# EAGLE design interacto (EAGLE 6.3)
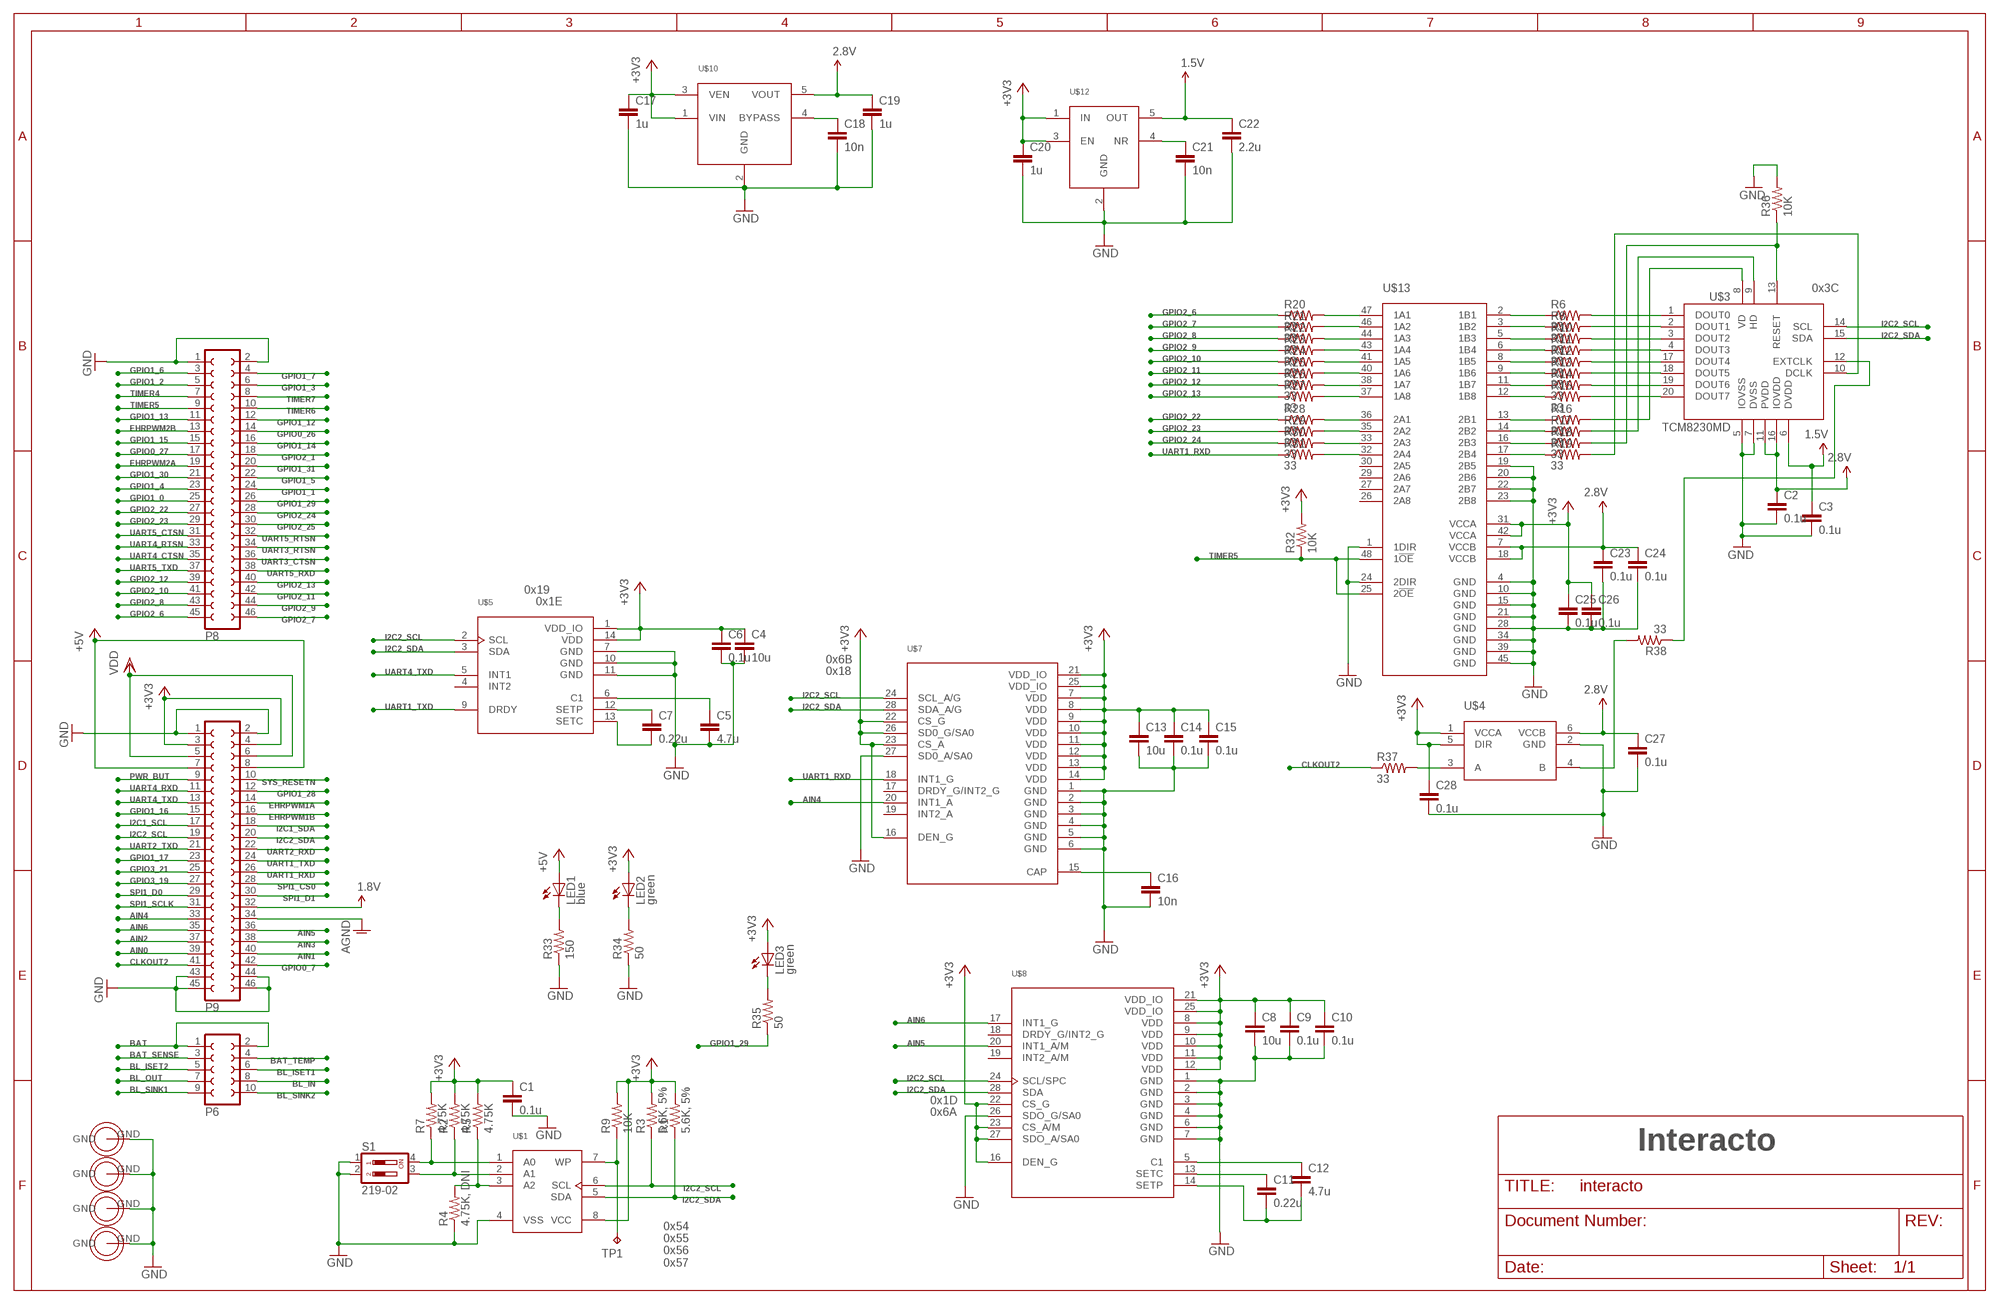
[diagram p0: schematic, sheet 1]

## Parts
C1  0.1u  C-EUC0603  [C0603]
C2  0.1u  C-EUC0603  [C0603]
C3  0.1u  C-EUC0603  [C0603]
C4  10u  C-EUC0603  [C0603]
C5  4.7u  C-EUC0603  [C0603]
C6  0.1u  C-EUC0603  [C0603]
C7  0.22u  C-EUC0603  [C0603]
C8  10u  C-EUC0603  [C0603]
C9  0.1u  C-EUC0603  [C0603]
C10  0.1u  C-EUC0603  [C0603]
C11  0.22u  C-EUC0603  [C0603]
C12  4.7u  C-EUC0603  [C0603]
C13  10u  C-EUC0603  [C0603]
C14  0.1u  C-EUC0603  [C0603]
C15  0.1u  C-EUC0603  [C0603]
C16  10n  C-EUC0603  [C0603]
C17  1u  C-EUC0603  [C0603]
C18  10n  C-EUC0603  [C0603]
C19  1u  C-EUC0603  [C0603]
C20  1u  C-EUC0603  [C0603]
C21  10n  C-EUC0603  [C0603]
C22  2.2u  C-EUC0603  [C0603]
C23  0.1u  C-EUC0603  [C0603]
C24  0.1u  C-EUC0603  [C0603]
C25  0.1u  C-EUC0603  [C0603]
C26  0.1u  C-EUC0603  [C0603]
C27  0.1u  C-EUC0603  [C0603]
C28  0.1u  C-EUC0603  [C0603]
H1  HOLE  [HOLE]
H2  HOLE  [HOLE]
H3  HOLE  [HOLE]
H4  HOLE  [HOLE]
LED1  blue  LEDCHIPLED_0603  [CHIPLED_0603]
LED2  green  LEDCHIPLED_0603  [CHIPLED_0603]
LED3  green  LEDCHIPLED_0603  [CHIPLED_0603]
P6  FE05-2  [FE05-2]
P8  FE23-2  [FE23-2]
P9  FE23-2  [FE23-2]
R1  5.6K, 5%  R-US_R0603  [R0603]
R2  4.75K  R-US_R0603  [R0603]
R3  5.6K, 5%  R-US_R0603  [R0603]
R4  4.75K, DNI  R-US_R0603  [R0603]
R5  4.75K  R-US_R0603  [R0603]
R6  33  R-US_R0402  [R0402]
R7  4.75K  R-US_R0603  [R0603]
R8  33  R-US_R0402  [R0402]
R9  10K  R-US_R0603  [R0603]
R10  33  R-US_R0402  [R0402]
R11  33  R-US_R0402  [R0402]
R12  33  R-US_R0402  [R0402]
R13  33  R-US_R0402  [R0402]
R14  33  R-US_R0402  [R0402]
R15  33  R-US_R0402  [R0402]
R16  33  R-US_R0402  [R0402]
R17  33  R-US_R0402  [R0402]
R18  33  R-US_R0402  [R0402]
R19  33  R-US_R0402  [R0402]
R20  33  R-US_R0402  [R0402]
R21  33  R-US_R0402  [R0402]
R22  33  R-US_R0402  [R0402]
R23  33  R-US_R0402  [R0402]
R24  33  R-US_R0402  [R0402]
R25  33  R-US_R0402  [R0402]
R26  33  R-US_R0402  [R0402]
R27  33  R-US_R0402  [R0402]
R28  33  R-US_R0402  [R0402]
R29  33  R-US_R0402  [R0402]
R30  33  R-US_R0402  [R0402]
R31  33  R-US_R0402  [R0402]
R32  10K  R-US_R0402  [R0402]
R33  150  R-US_R0603  [R0603]
R34  50  R-US_R0603  [R0603]
R35  50  R-US_R0603  [R0603]
R36  10K  R-US_R0402  [R0402]
R37  33  R-US_R0402  [R0402]
R38  33  R-US_R0402  [R0402]
S1  219-02  [CTS-219-02]
TP1  TPB2,54  [B2,54]
U$1  CAT24C256  [SOIC8]
U$3  TCM8230MD  [TCM8230MD]
U$4  SN74LVC1T45  [SOT23-6]
U$5  LSM303DLHC  [LGA14]
U$7  LSM330DLC  [LGA28-4X5]
U$8  LSM333D  [LGA28]
U$10  LP3985  [SOT23-5]
U$12  TPS799XX  [SOT23-5]
U$13  SN74LVCH16T245  [TSSOP48]

## Nets
1.5V [pwr]: C3.1 C22.1 U$3.6(DVDD) U$12.5(OUT)
1.8V: P9.32
2.85V [pwr]: C2.1 C19.1 C23.1 C24.1 C27.1 U$3.11(PVDD) U$3.16(IOVDD) U$4.6(VCCB) U$10.5(VOUT) U$13.7(VCCB) U$13.18(VCCB) ; supply symbol labelled 2.8V
+3V3 [pwr]: C1.1 C4.1 C6.1 C8.1 C9.1 C10.1 C13.1 C14.1 C15.1 C17.1 C20.1 C25.1 C26.1 C28.1 LED2.A LED3.A P9.3 P9.4 R1.2 R2.2 R3.2 R5.2 R7.2 R9.2 R32.2 U$1.8(VCC) U$4.1(VCCA) U$4.5(DIR) U$5.1(VDD_IO) U$5.14(VDD) U$7.7(VDD) U$7.8(VDD) U$7.9(VDD) U$7.10(VDD) U$7.11(VDD) U$7.12(VDD) U$7.13(VDD) U$7.14(VDD) U$7.16(DEN_G) U$7.21(VDD_IO) U$7.22(CS_G) U$7.23(CS_A) U$7.25(VDD_IO) U$7.26(SD0_G/SA0) U$8.8(VDD) U$8.9(VDD) U$8.10(VDD) U$8.11(VDD) U$8.12(VDD) U$8.16(DEN_G) U$8.21(VDD_IO) U$8.22(CS_G) U$8.23(CS_A/M) U$8.25(VDD_IO) U$8.27(SDO_A/SA0) U$10.1(VIN) U$10.3(VEN) U$12.1(IN) U$12.3(EN) U$13.31(VCCA) U$13.42(VCCA)
+5V: LED1.A P9.7 P9.8
AGND: P9.34
AIN0: P9.39
AIN1: P9.40
AIN2: P9.37
AIN3: P9.38
AIN4: P9.33 U$7.20(INT1_A)
AIN5: P9.36 U$8.20(INT1_A/M)
AIN6: P9.35 U$8.17(INT1_G)
BAT: P6.1 P6.2
BAT_SENSE: P6.3
BAT_TEMP: P6.4
BL_IN: P6.8
BL_ISET1: P6.6
BL_ISET2: P6.5
BL_OUT: P6.7
BL_SINK1: P6.9
BL_SINK2: P6.10
CLKOUT2: P9.41 R37.1
EHRPWM1A: P9.14
EHRPWM1B: P9.16
EHRPWM2A: P8.19
EHRPWM2B: P8.13
GND [pwr]: C1.2 C2.2 C3.2 C4.2 C5.2 C6.2 C8.2 C9.2 C10.2 C13.2 C14.2 C15.2 C16.2 C17.2 C18.2 C19.2 C20.2 C21.2 C22.2 C23.2 C24.2 C25.2 C26.2 C27.2 C28.2 H1.GND H2.GND H3.GND H4.GND P8.1 P8.2 P9.1 P9.2 P9.43 P9.44 P9.45 P9.46 R4.1 R33.1 R34.1 R36.2 S1.1 S1.2 U$1.4(VSS) U$3.5(IOVSS) U$3.7(DVSS) U$4.2(GND) U$5.7(GND) U$5.10(GND) U$5.11(GND) U$7.1(GND) U$7.2(GND) U$7.3(GND) U$7.4(GND) U$7.5(GND) U$7.6(GND) U$7.27(SD0_A/SA0) U$8.1(GND) U$8.2(GND) U$8.3(GND) U$8.4(GND) U$8.6(GND) U$8.7(GND) U$8.26(SDO_G/SA0) U$10.2(GND) U$12.2(GND) U$13.1(1DIR) U$13.4(GND) U$13.10(GND) U$13.15(GND) U$13.19(2B5) U$13.20(2B6) U$13.21(GND) U$13.22(2B7) U$13.23(2B8) U$13.24(2DIR) U$13.28(GND) U$13.34(GND) U$13.39(GND) U$13.45(GND)
GPIO0_7: P9.42
GPIO0_26: P8.14
GPIO0_27: P8.17
GPIO1_0: P8.25
GPIO1_1: P8.24
GPIO1_2: P8.5
GPIO1_3: P8.6
GPIO1_4: P8.23
GPIO1_5: P8.22
GPIO1_6: P8.3
GPIO1_7: P8.4
GPIO1_12: P8.12
GPIO1_13: P8.11
GPIO1_14: P8.16
GPIO1_15: P8.15
GPIO1_16: P9.15
GPIO1_17: P9.23
GPIO1_28: P9.12
GPIO1_29: P8.26 R35.1
GPIO1_30: P8.21
GPIO1_31: P8.20
GPIO2_1: P8.18
GPIO2_6: P8.45 R20.1
GPIO2_7: P8.46 R21.1
GPIO2_8: P8.43 R22.1
GPIO2_9: P8.44 R23.1
GPIO2_10: P8.41 R24.1
GPIO2_11: P8.42 R25.1
GPIO2_12: P8.39 R26.1
GPIO2_13: P8.40 R27.1
GPIO2_22: P8.27 R28.1
GPIO2_23: P8.29 R29.1
GPIO2_24: P8.28 R30.1
GPIO2_25: P8.30
GPIO3_19: P9.27
GPIO3_21: P9.25
I2C1_SCL: P9.17
I2C1_SDA: P9.18
I2C2_SCL: P9.19 R3.1 U$1.6(SCL) U$3.14(SCL) U$5.2(SCL) U$7.24(SCL_A/G) U$8.24(SCL/SPC)
I2C2_SDA: P9.20 R1.1 U$1.5(SDA) U$3.15(SDA) U$5.3(SDA) U$7.28(SDA_A/G) U$8.28(SDA)
N$1: R7.1 S1.4 U$1.1(A0)
N$2: R2.1 S1.3 U$1.2(A1)
N$3: R4.2 R5.1 U$1.3(A2)
N$4: R6.1 U$13.2(1B1)
N$5: R9.1 TP1.TP U$1.7(WP)
N$6: R8.1 U$13.3(1B2)
N$7: R10.1 U$13.5(1B3)
N$8: R11.1 U$13.6(1B4)
N$9: R12.1 U$13.8(1B5)
N$10: R13.1 U$13.9(1B6)
N$11: R14.1 U$13.11(1B7)
N$12: R15.1 U$13.12(1B8)
N$13: R19.2 U$3.10(DCLK)
N$14: R16.2 U$3.8(VD)
N$15: R17.2 U$3.9(HD)
N$16: R18.2 R36.1 U$3.13(RESET)
N$17: R28.2 U$13.36(2A1)
N$18: LED1.C R33.2
N$19: LED2.C R34.2
N$20: R16.1 U$13.13(2B1)
N$21: R17.1 U$13.14(2B2)
N$22: R18.1 U$13.16(2B3)
N$23: R19.1 U$13.17(2B4)
N$24: R6.2 U$3.1(DOUT0)
N$25: R8.2 U$3.2(DOUT1)
N$26: R10.2 U$3.3(DOUT2)
N$27: R11.2 U$3.4(DOUT3)
N$28: R12.2 U$3.17(DOUT4)
N$29: R13.2 U$3.18(DOUT5)
N$30: R14.2 U$3.19(DOUT6)
N$31: R15.2 U$3.20(DOUT7)
N$32: R20.2 U$13.47(1A1)
N$33: R21.2 U$13.46(1A2)
N$34: R22.2 U$13.44(1A3)
N$35: R23.2 U$13.43(1A4)
N$36: R24.2 U$13.41(1A5)
N$37: R25.2 U$13.40(1A6)
N$38: R26.2 U$13.38(1A7)
N$39: R27.2 U$13.37(1A8)
N$40: R29.2 U$13.35(2A2)
N$41: R30.2 U$13.33(2A3)
N$42: R31.2 U$13.32(2A4)
N$43: LED3.C R35.2
N$45: C7.1 U$5.12(SETP)
N$46: C7.2 U$5.13(SETC)
N$47: C5.1 U$5.6(C1)
N$48: C16.1 U$7.15(CAP)
N$50: C11.1 U$8.13(SETC)
N$51: C11.2 C12.2 U$8.14(SETP)
N$52: C12.1 U$8.5(C1)
N$53: C18.1 U$10.4(BYPASS)
N$54: R38.1 U$3.12(EXTCLK)
N$55: R37.2 U$4.3(A)
N$56: C21.1 U$12.4(NR)
N$57: R38.2 U$4.4(B)
PWR_BUT: P9.9
SPI1_CS0: P9.28
SPI1_D0: P9.29
SPI1_D1: P9.30
SPI1_SCLK: P9.31
SYS_RESETN: P9.10
TIMER4: P8.7
TIMER5: P8.9 R32.1 U$13.25(2!OE) U$13.48(1!OE)
TIMER6: P8.10
TIMER7: P8.8
UART1_RXD: P9.26 R31.1 U$7.18(INT1_G)
UART1_TXD: P9.24 U$5.9(DRDY)
UART2_RXD: P9.22
UART2_TXD: P9.21
UART3_CTSN: P8.36
UART3_RTSN: P8.34
UART4_CTSN: P8.35
UART4_RTSN: P8.33
UART4_RXD: P9.11
UART4_TXD: P9.13 U$5.5(INT1)
UART5_CTSN: P8.31
UART5_RTSN: P8.32
UART5_RXD: P8.38
UART5_TXD: P8.37
VDD: P9.5 P9.6
Unconnected: U$5.4(INT2) U$7.17(DRDY_G/INT2_G) U$7.19(INT2_A) U$8.18(DRDY_G/INT2_G) U$8.19(INT2_A/M) U$13.26(2A8) U$13.27(2A7) U$13.29(2A6) U$13.30(2A5)

## Notes on the sheet
- 0x3C
- 0x19
- 0x1E
- 0x6B
- 0x18
- 0x1D
- 0x6A
- Interacto
- 0x54
  0x55
  0x56
  0x57

## Library data of the parts
C1-C3 C6 C9 C10 C14 C15 C23-C28 = rcl:C-EU: CAPACITOR, European symbol; MPN: VJ0603V104ZXXCW1BC
C4 C8 C13 = rcl:C-EU: CAPACITOR, European symbol; MPN: LMK107BBJ106MALT
C5 C12 = rcl:C-EU: CAPACITOR, European symbol; MPN: GRM188F51A475ZE20J
C7 C11 = rcl:C-EU: CAPACITOR, European symbol; MPN: VJ0603V224MXJPW1BC
C16 C18 C21 = rcl:C-EU: CAPACITOR, European symbol; MPN: VJ0603Y103KXACW1BC
C17 C19 C20 = rcl:C-EU: CAPACITOR, European symbol; MPN: C1608X7R1C105K
C22 = rcl:C-EU: CAPACITOR, European symbol; MPN: C1608Y5V1C225Z
H1-H4 = BoneCapeParts:HOLE
LED1 = led:LED: LED OSRAM: - CHIPLED LG R971, LG N971, LY N971, LG Q971, LY Q971, LO R971, LY R971 LH N974, LH R974 LS Q976, LO Q976, LY Q976 LO Q996 - Hyper CHIPLED LW Q18S LB Q993, LB Q99A, LB R99A - SideLED LS A670, LO A670, LY A670, LG A670, LP A670 LB A673, LV A673, LT A673, LW A673 LH A674 LY A675 LS A676, LA A676, LO A676, LY A676, LW A676 LS A679, LY A679, LG A679 - Hyper Micro SIDELED® LS Y876, LA Y876, LO Y876, LY Y876 LT Y87S - SmartLED LW L88C, LW L88S LB L89C, LB L89S, LG L890 LS L89K, LO L89K, LY L89K LS L896, LA L896, LO L896, LY L896 - TOPLED LS T670, LO T670, LY T670, LG T670, LP T670 LSG T670, LSP T670, LSY T670, LOP T670, LYG T670 LG T671, LOG T671, LSG T671 LB T673, LV T673, LT T673, LW T673 LH T674 LS T676, LA T676, LO T676, LY T676, LB T676, LH T676, LSB T676, LW T676 LB T67C, LV T67C, LT T67C, LS T67K, LO T67K, LY T67K, LW E67C LS E67B, LA E67B, LO E67B, LY E67B, LB E67C, LV E67C, LT E67C LW T67C LS T679, LY T679, LG T679 LS T770, LO T770, LY T770, LG T770, LP T770 LB T773, LV T773, LT T773, LW T773 LH T774 LS E675, LA E675, LY E675, LS T675 LS T776, LA T776, LO T776, LY T776, LB T776 LHGB T686 LT T68C, LB T68C - Hyper Mini TOPLED® LB M676 - Mini TOPLED Santana® LG M470 LS M47K, LO M47K, LY M47K Source: http://www.osram.convergy.de LUXEON: - LUMILED® LXK2-PW12-R00, LXK2-PW12-S00, LXK2-PW14-U00, LXK2-PW14-V00 LXK2-PM12-R00, LXK2-PM12-S00, LXK2-PM14-U00 LXK2-PE12-Q00, LXK2-PE12-R00, LXK2-PE12-S00, LXK2-PE14-T00, LXK2-PE14-U00 LXK2-PB12-K00, LXK2-PB12-L00, LXK2-PB12-M00, LXK2-PB14-N00, LXK2-PB14-P00, LXK2-PB14-Q00 LXK2-PR12-L00, LXK2-PR12-M00, LXK2-PR14-Q00, LXK2-PR14-R00 LXK2-PD12-Q00, LXK2-PD12-R00, LXK2-PD12-S00 LXK2-PH12-R00, LXK2-PH12-S00 LXK2-PL12-P00, LXK2-PL12-Q00, LXK2-PL12-R00 Source: www.luxeon.com KINGBRIGHT: KA-3528ASYC Source: www.kingbright.com; MPN: HT-193NB-5589
LED2 LED3 = led:LED: LED OSRAM: - CHIPLED LG R971, LG N971, LY N971, LG Q971, LY Q971, LO R971, LY R971 LH N974, LH R974 LS Q976, LO Q976, LY Q976 LO Q996 - Hyper CHIPLED LW Q18S LB Q993, LB Q99A, LB R99A - SideLED LS A670, LO A670, LY A670, LG A670, LP A670 LB A673, LV A673, LT A673, LW A673 LH A674 LY A675 LS A676, LA A676, LO A676, LY A676, LW A676 LS A679, LY A679, LG A679 - Hyper Micro SIDELED® LS Y876, LA Y876, LO Y876, LY Y876 LT Y87S - SmartLED LW L88C, LW L88S LB L89C, LB L89S, LG L890 LS L89K, LO L89K, LY L89K LS L896, LA L896, LO L896, LY L896 - TOPLED LS T670, LO T670, LY T670, LG T670, LP T670 LSG T670, LSP T670, LSY T670, LOP T670, LYG T670 LG T671, LOG T671, LSG T671 LB T673, LV T673, LT T673, LW T673 LH T674 LS T676, LA T676, LO T676, LY T676, LB T676, LH T676, LSB T676, LW T676 LB T67C, LV T67C, LT T67C, LS T67K, LO T67K, LY T67K, LW E67C LS E67B, LA E67B, LO E67B, LY E67B, LB E67C, LV E67C, LT E67C LW T67C LS T679, LY T679, LG T679 LS T770, LO T770, LY T770, LG T770, LP T770 LB T773, LV T773, LT T773, LW T773 LH T774 LS E675, LA E675, LY E675, LS T675 LS T776, LA T776, LO T776, LY T776, LB T776 LHGB T686 LT T68C, LB T68C - Hyper Mini TOPLED® LB M676 - Mini TOPLED Santana® LG M470 LS M47K, LO M47K, LY M47K Source: http://www.osram.convergy.de LUXEON: - LUMILED® LXK2-PW12-R00, LXK2-PW12-S00, LXK2-PW14-U00, LXK2-PW14-V00 LXK2-PM12-R00, LXK2-PM12-S00, LXK2-PM14-U00 LXK2-PE12-Q00, LXK2-PE12-R00, LXK2-PE12-S00, LXK2-PE14-T00, LXK2-PE14-U00 LXK2-PB12-K00, LXK2-PB12-L00, LXK2-PB12-M00, LXK2-PB14-N00, LXK2-PB14-P00, LXK2-PB14-Q00 LXK2-PR12-L00, LXK2-PR12-M00, LXK2-PR14-Q00, LXK2-PR14-R00 LXK2-PD12-Q00, LXK2-PD12-R00, LXK2-PD12-S00 LXK2-PH12-R00, LXK2-PH12-S00 LXK2-PL12-P00, LXK2-PL12-Q00, LXK2-PL12-R00 Source: www.luxeon.com KINGBRIGHT: KA-3528ASYC Source: www.kingbright.com; MPN: LG Q971-KN-1
P6 = con-lsta:FE05-2: FEMALE HEADER; MPN: SSHQ-105-D-10-GT-LF; OC_FARNELL: unknown; OC_NEWARK: unknown
P8 P9 = BoneCapeParts:FE23-2: FEMALE HEADER; MPN: SSHQ-123-D-10-GT-LF; OC_FARNELL: unknown; OC_NEWARK: unknown
R1 R3 = rcl:R-US_: RESISTOR, American symbol; MPN: RK73B1JTTDD562J
R2 R4 R5 R7 = rcl:R-US_: RESISTOR, American symbol; MPN: CR0603-FX-4751GLF
R6 R8 R10-R23 R25-R31 R37 R38 = rcl:R-US_: RESISTOR, American symbol; MPN: CR0402-JW-330GLF
R9 R32 R36 = rcl:R-US_: RESISTOR, American symbol; MPN: WR06X1002FTL
R24 = rcl:R-US_: RESISTOR, American symbol
R33 = rcl:R-US_: RESISTOR, American symbol; MPN: 302-150-RC
R34 R35 = rcl:R-US_: RESISTOR, American symbol; MPN: 302-49.9-RC
S1 = switch-dil:219-02*: Surface Mount DIP Switch Series 219 SMT CTS Electronic Components Sourc: www.ctscorp.com; MPN: 219-2MST; OC_FARNELL: unknown; OC_NEWARK: unknown
TP1 = testpad:TP: Test pad
U$1 = BoneCapeParts:CAT24C256; MPN: CAT24C256WI-GT3
U$3 = BoneCapeParts:TCM8230MD; MPN: TCM8230MD
U$4 = BoneCapeParts:SN74LVC1T45; MPN: SN74LVC1T45DBVR
U$5 = BoneCapeParts:LSM303DLHC; MPN: LSM303DLHC
U$7 = BoneCapeParts:LSM330DLC; MPN: LSM330DLC
U$8 = BoneCapeParts:LSM333D; MPN: LSM333D
U$10 = BoneCapeParts:LP3985; MPN: LP3985IM5-2.8/NOPB
U$12 = BoneCapeParts:TPS799XX; MPN: TPS79915DDCR
U$13 = BoneCapeParts:SN74LVCH16T245; MPN: SN74LVCH16T245DGGR

## Net classes
0 default: width 0.152 mm, drill 0.381 mm, clearance 0.152 mm
1 pwr: width 0.305 mm, drill 0.381 mm, clearance 0.152 mm

## Board
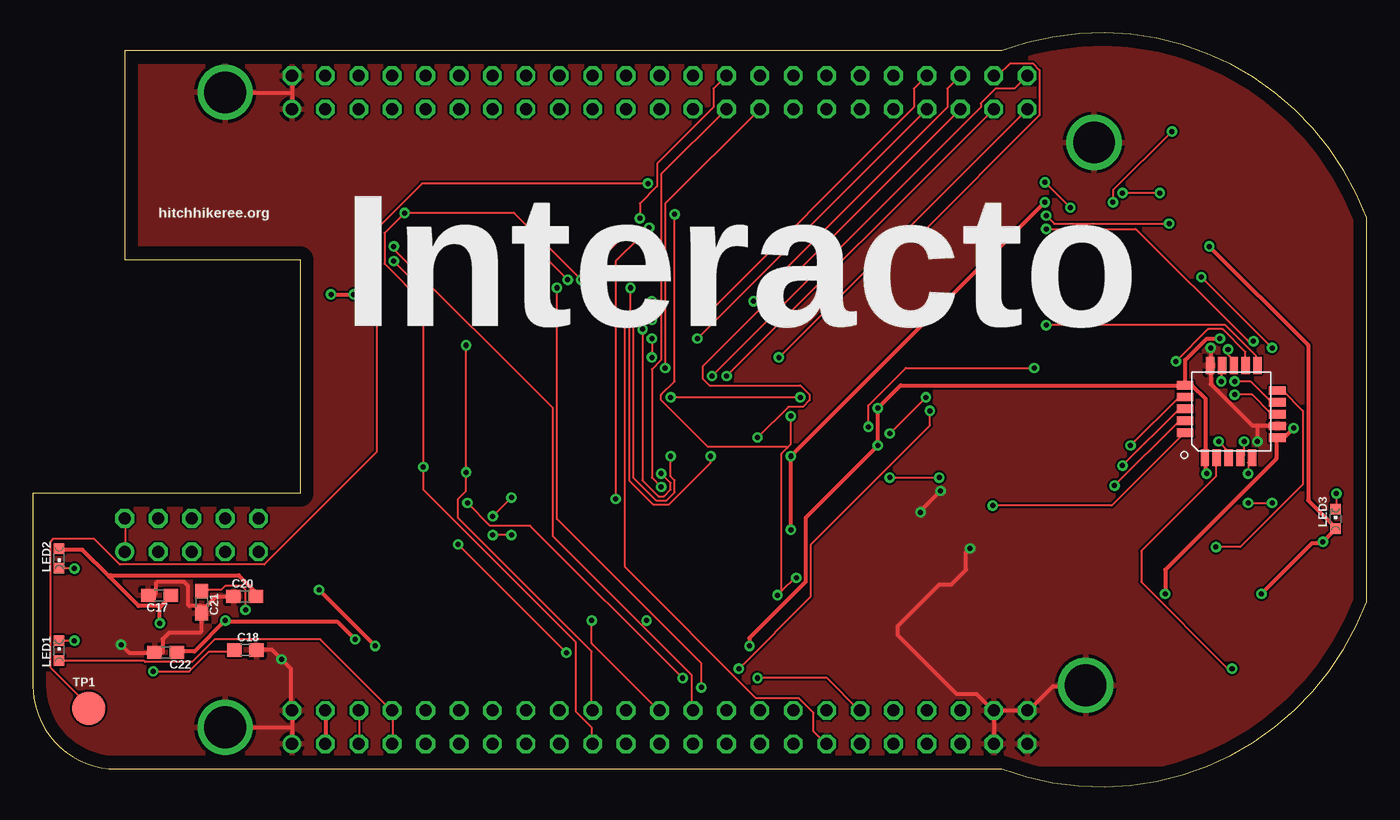
[diagram p1: board, top side]
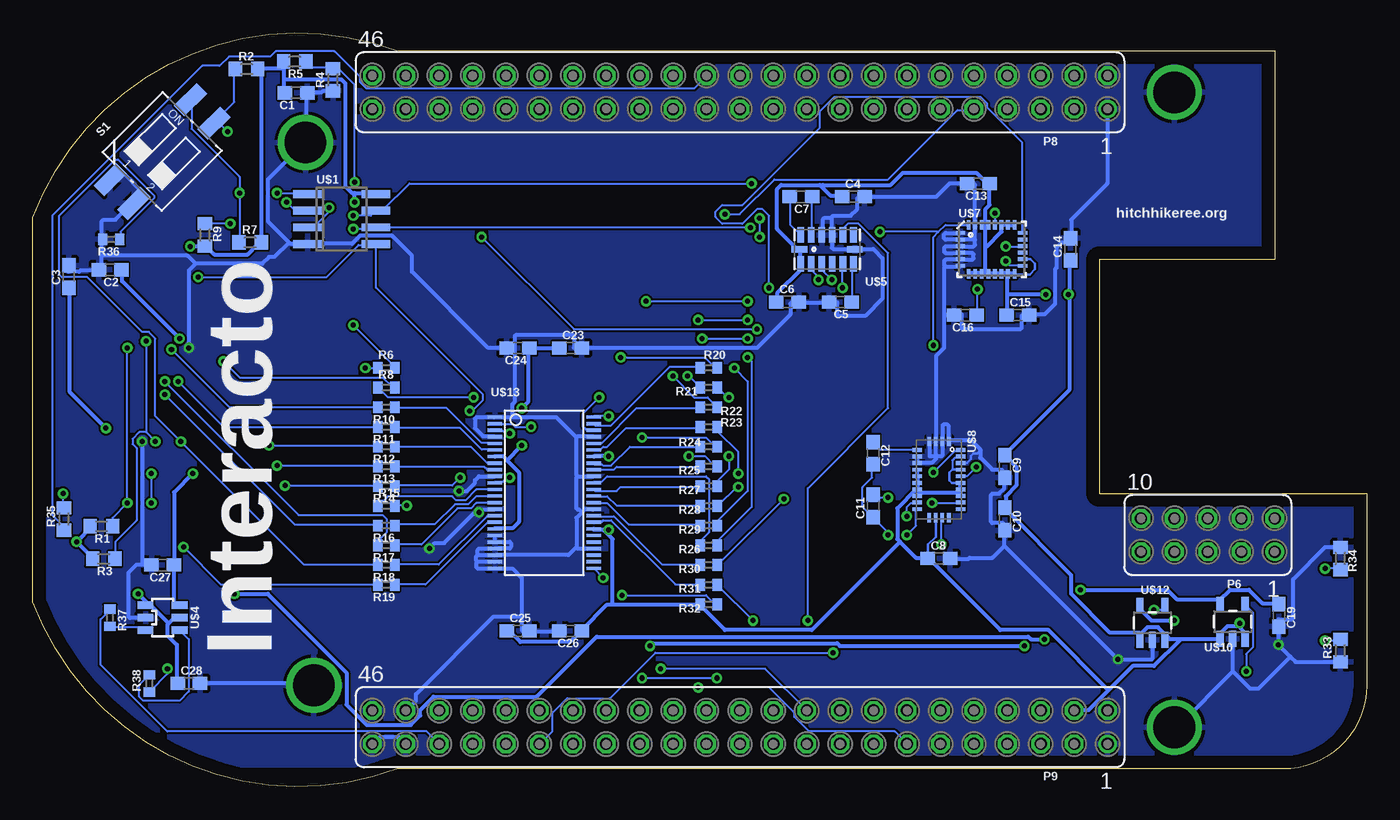
[diagram p2: board, bottom side, seen from below]

Size 101.36 x 57.3 mm. Coordinates in mm from the lower left corner, seen from the top.
Outline: 0,22.3 0,7.7 arc90 6.35,1.35 73.66,1.35 arc90 101.36,14.05 101.36,43.26 arc90 73.66,55.96 6.99,55.96 6.99,40.08 20.32,40.08 20.32,22.3 0,22.3
Copper layers (1*16): Top 0.035mm / dielectric 1.5mm / Bottom 0.035mm
Design rules "default *": minimum track width 6mil, minimum drill 15mil, track to track 6mil, track to pad 6mil, pad to pad 6mil, via to via 6mil, smd to smd 6mil, copper to edge 40mil, drill to drill 8mil, minimum pad ring 10mil, minimum via ring 8mil, stop-mask expansion 4mil, vias tented up to drill 20mil, thermal gap 10mil

### Footprints (pad centres in the part's own frame; a part is rotated, then mirrored left to right if it is on the bottom)
C0603 = smd 1.1 x 1: 1 -0.85,0; 2 0.85,0
HOLE = drill 3.175: GND 0,0
CHIPLED_0603 = smd 0.8 x 0.8: A 0,-0.75; C 0,0.75
FE05-2 = drill 0.914: 1 -5.08,1.27 | drill 0.914 octagon: 2 -5.08,-1.27; 3 -2.54,1.27; 4 -2.54,-1.27; 5 0,1.27; 6 0,-1.27; 7 2.54,1.27; 8 2.54,-1.27; 9 5.08,1.27; 10 5.08,-1.27
FE23-2 = drill 0.914: 1 -24.13,1.27 | drill 0.914 octagon: 2 -24.13,-1.27; 3 -21.59,1.27; 4 -21.59,-1.27; 5 -19.05,1.27; 6 -19.05,-1.27; 7 -16.51,1.27; 8 -16.51,-1.27; 9 -13.97,1.27; 10 -13.97,-1.27; 11 -11.43,1.27; 12 -11.43,-1.27; 13 -8.89,1.27; 14 -8.89,-1.27; 15 -6.35,1.27; 16 -6.35,-1.27; 17 -3.81,1.27; 18 -3.81,-1.27; 19 -1.27,1.27; 20 -1.27,-1.27; 21 1.27,1.27; 22 1.27,-1.27; 23 3.81,1.27; 24 3.81,-1.27; 25 6.35,1.27; 26 6.35,-1.27; 27 8.89,1.27; 28 8.89,-1.27; 29 11.43,1.27; 30 11.43,-1.27; 31 13.97,1.27; 32 13.97,-1.27; 33 16.51,1.27; 34 16.51,-1.27; 35 19.05,1.27; 36 19.05,-1.27; 37 21.59,1.27; 38 21.59,-1.27; 39 24.13,1.27; 40 24.13,-1.27; 41 26.67,1.27; 42 26.67,-1.27; 43 29.21,1.27; 44 29.21,-1.27; 45 31.75,1.27; 46 31.75,-1.27
R0603 = smd 1 x 1.1: 1 -0.85,0; 2 0.85,0
R0402 = smd 0.7 x 0.9: 1 -0.65,0; 2 0.65,0
CTS-219-02 = smd 1.13 x 2.44: 1 -1.27,-4.3; 2 1.27,-4.3; 3 1.27,4.3; 4 -1.27,4.3
B2,54 = smd 2.54 x 2.54: TP 0,0
SOIC8 = smd 0.6 x 2.2: 1 -1.905,-2.6; 2 -0.635,-2.6; 3 0.635,-2.6; 4 1.905,-2.6; 5 1.905,2.6; 6 0.635,2.6; 7 -0.635,2.6; 8 -1.905,2.6
TCM8230MD = smd 0.635 x 1.27: 1 -2,-3.5; 2 -1.1,-3.5; 3 -0.2,-3.5; 4 0.7,-3.5; 5 1.6,-3.5; 11 2,3.5; 12 1.1,3.5; 13 0.2,3.5; 14 -0.7,3.5; 15 -1.6,3.5 | smd 1.27 x 0.635: 6 -3.5,2; 7 -3.5,1.1; 8 -3.5,0.2; 9 -3.5,-0.7; 10 -3.5,-1.6; 16 3.5,-2; 17 3.5,-1.1; 18 3.5,-0.2; 19 3.5,0.7; 20 3.5,1.6
SOT23-6 = smd 0.55 x 1.2: 1 -0.95,-1.3; 2 0,-1.3; 3 0.95,-1.3; 4 0.95,1.3; 5 0,1.3; 6 -0.95,1.3
LGA14 = smd 0.5 x 1.2: 1 2,1.1; 2 1.2,1.1; 3 0.4,1.1; 4 -0.4,1.1; 5 -1.2,1.1; 6 -2,1.1; 8 -2,-1.1; 9 -1.2,-1.1; 10 -0.4,-1.1; 11 0.4,-1.1; 12 1.2,-1.1; 13 2,-1.1 | smd 1.2 x 0.5: 7 -2.1,0; 14 2.1,0
LGA28-4X5 = smd 0.7 x 0.29: 1 -2.362,1.25; 2 -2.362,0.75; 3 -2.362,0.25; 4 -2.362,-0.25; 5 -2.362,-0.75; 6 -2.362,-1.25; 15 2.362,-1.25; 16 2.362,-0.75; 17 2.362,-0.25; 18 2.362,0.25; 19 2.362,0.75; 20 2.362,1.25 | smd 0.29 x 0.7: 7 -1.75,-1.863; 8 -1.25,-1.863; 9 -0.75,-1.863; 10 -0.25,-1.863; 11 0.25,-1.863; 12 0.75,-1.863; 13 1.25,-1.863; 14 1.75,-1.863; 21 1.75,1.863; 22 1.25,1.863; 23 0.75,1.863; 24 0.25,1.863; 25 -0.25,1.863; 26 -0.75,1.863; 27 -1.25,1.863; 28 -1.75,1.863
LGA28 = smd 0.7 x 0.29: 1 -2.9,0.75; 2 -2.9,0.25; 3 -2.9,-0.25; 4 -2.9,-0.75; 15 2.9,-0.75; 16 2.9,-0.25; 17 2.9,0.25; 18 2.9,0.75 | smd 0.29 x 0.7: 5 -2.25,-1.65; 6 -1.75,-1.65; 7 -1.25,-1.65; 8 -0.75,-1.65; 9 -0.25,-1.65; 10 0.25,-1.65; 11 0.75,-1.65; 12 1.25,-1.65; 13 1.75,-1.65; 14 2.25,-1.65; 19 2.25,1.65; 20 1.75,1.65; 21 1.25,1.65; 22 0.75,1.65; 23 0.25,1.65; 24 -0.25,1.65; 25 -0.75,1.65; 26 -1.25,1.65; 27 -1.75,1.65; 28 -2.25,1.65
SOT23-5 = smd 0.55 x 1.2: 1 -0.95,-1.3; 2 0,-1.3; 3 0.95,-1.3; 4 0.95,1.3; 5 -0.95,1.3
TSSOP48 = smd 0.25 x 1.1: 1 0.75,1.25; 2 1.25,1.25; 3 1.75,1.25; 4 2.25,1.25; 5 2.75,1.25; 6 3.25,1.25; 7 3.75,1.25; 8 4.25,1.25; 9 4.75,1.25; 10 5.25,1.25; 11 5.75,1.25; 12 6.25,1.25; 13 6.75,1.25; 14 7.25,1.25; 15 7.75,1.25; 16 8.25,1.25; 17 8.75,1.25; 18 9.25,1.25; 19 9.75,1.25; 20 10.25,1.25; 21 10.75,1.25; 22 11.25,1.25; 23 11.75,1.25; 24 12.25,1.25; 25 12.25,8.75; 26 11.75,8.75; 27 11.25,8.75; 28 10.75,8.75; 29 10.25,8.75; 30 9.75,8.75; 31 9.25,8.75; 32 8.75,8.75; 33 8.25,8.75; 34 7.75,8.75; 35 7.25,8.75; 36 6.75,8.75; 37 6.25,8.75; 38 5.75,8.75; 39 5.25,8.75; 40 4.75,8.75; 41 4.25,8.75; 42 3.75,8.75; 43 3.25,8.75; 44 2.75,8.75; 45 2.25,8.75; 46 1.75,8.75; 47 1.25,8.75; 48 0.75,8.75

### Placement (x,y rotation side)
C1  81.36,52.74 0 bottom
C2  95.5,39.29 180 bottom
C3  98.62,38.77 90 bottom
C4  39,44.85 0 bottom
C5  40,36.85 180 bottom
C6  44,36.85 0 bottom
C7  43,44.85 180 bottom
C8  32.5,17.35 0 bottom
C9  27.5,24.35 270 bottom
C10  27.5,20.35 270 bottom
C11  37.5,21.35 270 bottom
C12  37.5,25.35 270 bottom
C13  29.5,45.85 180 bottom
C14  22.5,40.85 90 bottom
C15  26.5,35.85 0 bottom
C16  30.5,35.85 180 bottom
C17  9.63,14.55 180 top
C18  16.15,10.39 0 top
C19  6.66,13.02 270 bottom
C20  16.1,14.46 180 top
C21  12.83,14.02 270 top
C22  10.1,10.22 180 top
C23  60.5,33.35 0 bottom
C24  64.5,33.35 180 bottom
C25  64.5,11.85 0 bottom
C26  60.5,11.85 180 bottom
C27  91.5,16.85 180 bottom
C28  89.5,7.85 0 bottom
H1  14.61,4.52 0 top
H2  80.01,7.7 0 top
H3  14.61,52.78 0 top
H4  80.64,48.97 0 top
LED1  2,10.35 0 top
LED2  2,17.35 180 top
LED3  99,20.35 0 top
P6  12.06,19.13 180 bottom
P8  43.81,52.78 180 bottom
P9  43.81,4.52 180 bottom
R1  96.15,19.79 180 bottom
R2  85.12,54.55 0 bottom
R3  95.97,17.32 180 bottom
R4  78.55,53.74 90 bottom
R5  81.46,55.12 180 bottom
R6  74.5,31.85 0 bottom
R7  84.85,41.37 0 bottom
R8  74.5,30.35 0 bottom
R9  88.28,41.94 270 bottom
R10  74.5,28.85 180 bottom
R11  74.5,27.35 180 bottom
R12  74.5,25.85 180 bottom
R13  74.5,24.35 180 bottom
R14  74.5,22.85 180 bottom
R15  74.5,21.35 0 bottom
R16  74.5,19.85 180 bottom
R17  74.5,18.35 180 bottom
R18  74.5,16.85 180 bottom
R19  74.5,15.35 180 bottom
R20  50,31.85 180 bottom
R21  50,30.35 0 bottom
R22  50,28.85 180 bottom
R23  50,27.35 180 bottom
R24  50,25.85 180 bottom
R25  50,24.35 180 bottom
R26  50,18.35 180 bottom
R27  50,22.85 180 bottom
R28  50,21.35 180 bottom
R29  50,19.85 180 bottom
R30  50,16.85 180 bottom
R31  50,15.35 180 bottom
R32  50,13.85 180 bottom
R33  2,10.35 90 bottom
R34  2,17.35 270 bottom
R35  99,20.35 90 bottom
R36  95.41,41.61 180 bottom
R37  95.5,12.85 270 bottom
R38  92.5,7.85 90 bottom
S1  91.54,48.28 315 bottom
TP1  4.26,5.95 0 top
U$1  77.89,43.15 270 bottom
U$3  91.06,28.52 180 top
U$4  91.5,12.85 270 bottom
U$5  41,40.85 180 bottom
U$7  28.5,40.85 0 bottom
U$8  32.5,23.35 270 bottom
U$10  10.18,12.54 0 bottom
U$12  16.27,12.45 0 bottom
U$13  67.5,28.85 270 bottom

### Tracks (layer width: path | path; a pad name or v marks a point on that pad's centre or on a via)
1.5V  (via drill 0.38)
  Top 0.305: C22.1 10.97,10.29 12.29,10.29 v14.63,12.62 14.73,12.52 23.16,12.52 v24.49,11.2 | v95.81,27.25 95.1,26.54 94.59,26.54 U$3.6 94.49,26.44 94.49,24.92 86.06,16.48 v86.06,14.66
  Bottom 0.305: v14.63,12.62 16.36,12.62 17.17,13.44 17.17,13.74 U$12.5 | v95.81,27.25 98.55,30 98.55,37.92 C3.1 | v24.49,11.2 25.5,11.2 25.7,11.4 58.52,11.4 63.09,6.83 70.92,6.83 71.93,5.82 71.93,5.41 72.64,4.7 76,4.7 77.52,6.22 77.52,8.66 83.52,14.66 v86.06,14.66
2.85V  (via drill 0.38)
  Top 0.305: v90.22,34.06 89.2,34.06 87.58,32.44 87.58,30.61 U$3.16 | U$3.16 87.68,30.5 88.09,30.5 89.1,29.49 89.1,25.02 U$3.11 89.1,24.92 89.1,23.9 v89.2,23.8 | v26.01,10.69 v21.74,14.96 | v54.46,10.69 54.46,11.3 58.73,15.57 58.73,20.45 v64.21,25.93 v64.21,28.78 65.94,30.5 87.48,30.5 U$3.16
  Bottom 0.305: U$4.6 90.22,13.84 90.53,13.84 90.63,13.94 90.63,16.79 C27.1 90.63,16.99 90.63,22.38 v89.2,23.8 | v90.22,34.06 94.59,38.43 94.59,39.24 C2.1 | C19.1 6.71,13.94 7.92,13.94 8.94,14.96 10.36,14.96 11.18,14.15 11.18,13.84 U$10.5 11.28,14.25 14.43,14.25 15.14,14.96 v21.74,14.96 | C23.1 61.37,33.35 63.6,33.35 C24.1 63.7,33.25 63.7,29.29 v64.21,28.78 | 65.33,24.82 65.63,25.12 66.24,25.12 U$13.7 | 65.33,24.82 64.41,23.9 64.41,20.14 64.92,19.63 66.24,19.63 U$13.18 | 65.33,24.82 v64.21,25.93 | v26.01,10.69 40.03,10.69 40.23,10.9 54.25,10.9 v54.46,10.69
+3V3  (via drill 0.38)
  Top 0.305: v93.37,14.66 97.23,18.52 97.94,18.52 v98.04,18.62 98.96,19.53 LED3.A 98.96,19.74 96.93,21.77 96.93,33.55 v89.41,41.07 | v57.61,19.53 v57.61,25.12 v76.91,44.42 | 5.79,15.98 8.03,13.74 9.65,13.74 | 5.79,15.98 3.76,18.01 2.03,18.01 LED2.A | 9.65,13.74 9.75,13.74 10.46,14.45 C17.1 | C20.1 16.87,14.55 16.87,14.86 15.65,16.08 5.89,16.08 5.79,15.98 | P9.3 22.25,3.28 22.25,5.71 P9.4 | v9.65,12.42 9.65,13.74 | v22.66,37.41 v24.38,37.41
  Bottom 0.152: U$8.27 31.32,24.99 31.5,24.82 31.5,24.1
  Bottom 0.203: U$8.23 31.5,23.1 31.7,23.29 31.7,23.9 31.5,24.1 U$8.25 | U$8.16 32.75,18.99 33.33,18.41 33.33,17.37 C8.1 | U$7.16 25.54,40.1 25.2,39.75 25.2,39.34 25.6,38.94 26.7,38.94 U$7.14
  Bottom 0.305: R1.2 96.93,19.74 v98.04,18.62 96.83,17.4 R3.2 | 91.03,12.42 90.63,12.83 90.22,12.83 U$4.5 | 91.03,12.42 91.14,12.32 91.14,11.51 90.42,10.79 90.42,7.85 C28.1 | 91.03,12.42 92.35,13.74 92.76,13.74 U$4.1 92.56,13.84 v93.37,14.66 | 82.3,53.77 82.3,55.09 R5.2 82.4,54.58 84.23,54.58 R2.2 84.02,54.48 84.02,41.48 R7.2 84.02,41.27 84.23,41.27 85.04,40.46 87.58,40.46 88.19,41.07 R9.2 88.39,41.07 v89.41,41.07 | 82.3,53.77 82.3,52.76 C1.1 | 76.91,45.14 77.11,45.14 77.62,45.64 77.62,53.47 77.93,53.77 82.3,53.77 | 76.91,45.14 75.39,45.14 U$1.8 | 57.3,13.84 57.71,13.84 59.64,11.91 C26.1 59.74,11.81 60.55,11 64.31,11 65.13,11.81 65.33,11.81 C25.1 | 57.3,13.84 50.7,13.84 R32.2 50.6,13.74 48.77,11.91 42.16,11.91 35.46,18.62 | 57.81,19.33 57.3,18.82 57.3,13.84 | 57.81,19.33 58.01,19.53 58.73,19.53 U$13.31 | v57.61,25.12 58.73,25.12 U$13.42 | v57.61,19.53 57.81,19.33 | U$7.21 26.82,42.7 27.23,42.7 U$7.22 27.33,42.7 27.74,42.7 U$7.23 27.74,42.6 27.74,42.19 28.85,41.07 28.96,41.07 | U$7.14 26.82,39.04 27.23,39.04 U$7.13 | U$7.13 27.33,39.04 27.74,39.04 U$7.12 27.84,39.04 28.14,39.04 U$7.11 28.35,39.04 28.65,39.04 U$7.10 28.85,39.04 28.96,39.04 | 28.96,42.7 29.16,42.7 U$7.26 | 28.96,42.7 U$7.25 | 28.96,39.04 29.16,39.04 U$7.9 29.36,39.04 29.67,39.04 U$7.8 29.87,39.04 30.18,39.04 U$7.7 | 28.96,39.04 28.96,41.07 | 28.96,41.07 28.96,42.7 | 27.33,37.41 27.33,38.94 U$7.13 | 27.33,37.41 27.33,35.89 C15.1 | 28.96,42.7 28.96,43.92 28.65,44.22 28.65,45.74 C13.1 28.75,45.95 28.96,45.95 29.67,46.66 35.26,46.66 36.17,45.74 41.35,45.74 41.45,45.64 | C6.1 44.81,36.91 44.81,37.52 43.08,39.24 43.08,39.65 U$5.1 43.08,39.85 43.08,40.66 U$5.14 43.18,40.77 44.81,42.39 44.81,45.44 44.5,45.74 41.55,45.74 41.45,45.64
  Bottom 0.305: 41.45,45.64 40.74,44.93 39.93,44.93 C4.1 | 22.55,37.41 22.55,30.2 27.43,25.32 C9.1 27.43,25.12 26.62,24.31 26.62,22.88 27.43,22.07 27.43,21.26 C10.1 27.43,21.06 22.45,16.08 22.45,14.66 19.51,11.71 17.27,11.71 U$12.1 17.17,11.2 17.17,11.61 16.66,12.12 15.85,12.12 15.04,11.3 15.04,11.2 | 22.55,37.41 22.55,39.95 C14.1 | 30.89,22.38 30.89,22.58 U$8.22 30.89,22.68 30.89,23.09 U$8.23 | 30.89,22.38 30.89,22.17 U$8.21 | 34.14,22.38 34.14,22.58 U$8.11 | 34.14,22.38 34.14,22.17 U$8.12 | U$8.8 34.14,24 34.14,23.7 U$8.9 34.14,23.49 34.14,23.19 U$8.10 34.14,22.99 34.14,22.68 U$8.11 | 34.14,22.38 30.89,22.38 | 35.46,18.62 35.66,18.82 35.66,21.16 34.24,22.58 U$8.11 | 35.46,18.62 34.24,17.4 33.43,17.4 C8.1 33.22,17.3 27.84,11.91 24.18,11.91 19.61,7.34 | 9.75,12.22 9.25,11.71 9.25,11.3 U$10.3 | 9.75,12.22 10.57,12.22 11.07,11.71 11.07,11.3 U$10.1 11.28,11.2 14.22,11.2 | 14.22,11.2 15.04,11.2 | 15.04,11.2 15.24,11.2 U$12.3 | 19.61,7.34 17.78,9.17 16.15,9.17 14.22,11.1 14.22,11.2 | 19.61,7.34 21.13,5.82 22.15,5.82 P9.4 | v9.65,12.42 9.65,12.32 9.75,12.22 | v24.38,37.41 27.33,37.41 | v22.66,37.41 22.55,37.41 | v76.91,44.42 76.91,45.14
+5V
  Top 0.152: LED1.A 2.03,9.58 8.43,9.58 8.53,9.47 12.09,9.47 13.82,11.2 21.84,11.2 27.23,5.82 P9.8 27.33,5.71 27.33,3.28 P9.7
AIN4  (via drill 0.38)
  Top 0.152: v45.41,37.92 45.41,35.79 45.01,35.38 45.01,16.69 54.97,6.73 58.22,6.73 59.33,5.61 59.33,4.19 60.25,3.28 P9.33
  Bottom 0.152: v45.41,37.92 45.41,43.41 45.92,43.92 46.33,43.92 47.45,42.8 48.97,42.8 49.48,43.31 49.48,43.71 48.97,44.22 47.45,44.22 41.55,50.11 41.55,51.33 40.44,52.45 29.36,52.45 28.85,51.94 28.85,51.64 26.21,49 26.21,42.19 U$7.20
AIN5  (via drill 0.38)
  Top 0.152: v33.02,21.56 34.75,19.84 37.8,19.84 v49.38,8.25 | v55.07,8.25 60.35,8.25 62.79,5.82 P9.36
  Bottom 0.152: v33.02,21.56 30.89,21.56 U$8.20 | v55.07,8.25 v49.38,8.25
AIN6  (via drill 0.38)
  Top 0.152: v40.54,10.18 v32.31,18.41
  Bottom 0.152: v32.31,18.41 32.31,20.34 U$8.17 | v40.54,10.18 54.05,10.18 57.51,6.73 60.76,6.73 61.87,5.61 61.87,4.19 62.79,3.28 P9.35
BAT
  Top 0.152: P6.1 7.01,17.91 7.01,20.34 P6.2
CLKOUT2
  Bottom 0.152: P9.41 71.42,4.19 91.14,4.19 96.22,9.27 96.22,12.72 95.5,13.44 R37.1
GND  (via drill 0.38)
  Top 0.305: 93.07,27.46 92.66,27.46 89.51,30.61 89.51,31.93 U$3.5 89.51,32.13 v89.51,33.35 | 93.07,27.46 94.49,27.46 U$3.7 | 93.07,27.46 v93.07,26.24 | v71.22,18.11 70.92,17.8 70.92,16.48 69.8,15.37 68.89,15.37 65.73,12.22 65.73,11.51 70.21,7.04 71.73,7.04 72.95,5.82 P9.44 | v68.99,22.48 67.46,20.95 v67.46,20.85 | P9.44 73.15,5.82 75.49,5.82 P9.46 75.69,5.82 77.52,7.64 79.96,7.64 H2.GND | P9.43 73.05,3.28 73.05,5.71 P9.44 | 19.71,52.76 19.71,53.97 P8.2 | 19.71,52.76 19.71,51.54 P8.1 | 19.71,52.76 14.63,52.76 H3.GND | C18.2 17.07,10.39 18.19,10.39 v18.9,9.68 19.61,8.97 19.61,5.82 P9.2 19.71,5.71 19.71,4.5 | 19.71,4.5 19.71,3.28 P9.1 | 19.71,4.5 14.63,4.5 H1.GND | 12.8,13.74 13.21,13.74 13.92,14.45 15.24,14.45 C20.2 | 12.8,13.74 12.8,13.23 C21.2 12.8,13.13 12.8,11.81 12.7,11.71 10.36,11.71 9.86,11.2 9.86,10.18 9.35,10.18 C22.2 9.14,10.18 7.32,10.18 v6.71,10.79 | 12.8,13.74 11.89,13.74 11.79,13.84 11.79,15.26 11.48,15.57 9.45,15.57 9.35,15.47 9.35,14.66 9.25,14.55 8.84,14.55 C17.2
  Bottom 0.203: U$8.26 30.39,24.6 30.07,24.92 30.07,25.12 29.87,25.32 29.57,25.32 29.36,25.53
  Bottom 0.305: 93.07,16.89 93.47,16.89 94.08,16.28 94.08,12.93 93.98,12.83 92.86,12.83 U$4.2 | 93.07,16.89 92.35,16.89 C27.2 | v93.07,26.24 93.07,16.89 | 96.11,40.36 96.11,39.24 96.32,39.24 C2.2 96.42,39.24 97.74,39.24 97.84,39.14 98.65,39.14 98.65,39.55 C3.2 | 96.11,40.36 96.11,41.58 R36.2 96.11,41.68 96.11,43 96.01,43.1 95.1,43.1 93.88,44.32 93.78,44.32 S1.2 93.57,44.42 92.96,45.03 92.96,45.14 94.59,46.76 94.69,46.76 95.3,46.15 95.4,46.15 S1.1 | R4.1 78.64,52.86 79.35,52.86 79.45,52.76 80.47,52.76 C1.2 80.57,52.65 80.57,49 H4.GND 80.77,48.89 83.52,46.15 83.52,43 81.89,41.38 | 81.89,41.38 81.79,41.27 80.57,41.27 U$1.4 80.37,41.27 77.11,41.27 76.5,41.88 74.07,41.88 72.54,40.36 72.54,39.14 66.75,33.35 65.43,33.35 C24.2 65.33,33.35 64.72,33.35 | 96.11,40.36 89.61,40.36 89,39.75 | 89,39.75 83.92,39.75 83.41,40.26 83.01,40.26 81.89,41.38 | v89.51,33.35 89.51,39.24 89,39.75 | C26.2 61.37,11.81 63.6,11.81 C25.2 63.7,11.81 64.11,11.81 64.21,11.91 64.21,12.93 | U$13.19 66.24,19.02 66.24,18.72 U$13.20 66.24,18.62 65.13,18.62 65.02,18.52 65.02,18.21 65.13,18.11 66.24,18.11 U$13.21 66.34,18.11 67.46,18.11 67.56,18.01 67.56,17.6 | 67.56,17.09 67.67,16.99 67.67,16.69 67.56,16.59 66.34,16.59 U$13.24 66.14,16.59 64.92,16.59 64.21,15.87 64.21,12.93 | 67.56,17.09 66.34,17.09 U$13.23 | 67.56,17.6 66.34,17.6 U$13.22 66.14,17.6 60.66,17.6 60.05,18.21 | 67.56,17.6 67.67,17.5 67.67,17.2 67.56,17.09 | 64.72,33.35 64.72,34.26 64.62,34.37 60.35,34.37 60.25,34.26 60.25,33.35 59.74,33.35 C23.2 59.54,33.35 46.33,33.35 43.79,35.89 43.79,36.7 43.69,36.8 43.28,36.8 C6.2 43.08,36.8 40.95,36.8 C5.2 40.74,36.8 40.23,36.8 40.23,35.89 40.13,35.79 38.1,35.79 36.78,37.11 36.78,40.16 37.49,40.87 38.81,40.87 U$5.7 38.91,40.87 40.54,40.87 40.64,40.97 40.64,41.88 U$5.10 40.64,41.99 40.64,43.31
  Bottom 0.305: U$13.4 66.34,26.64 67.16,26.64 67.77,27.25 67.77,27.96 67.67,28.07 66.34,28.07 U$13.1 66.14,28.07 64.92,28.07 | 60.05,18.21 59.94,18.11 58.83,18.11 U$13.28 | 60.05,18.21 60.05,20.45 59.64,20.85 | 59.64,20.85 59.44,21.06 58.83,21.06 U$13.34 | 59.94,23.6 58.83,23.6 U$13.39 | 59.94,23.6 60.05,23.49 60.05,21.16 59.94,21.06 59.84,21.06 59.64,20.85 | 60.05,26.54 59.94,26.64 58.83,26.64 U$13.45 | 60.05,26.54 60.05,23.7 59.94,23.6 | 64.92,28.07 61.57,28.07 60.05,26.54 | 64.72,33.35 64.72,29.29 64.92,29.08 64.92,28.07 | H2.GND 80.16,7.85 88.59,7.85 C28.2 | P9.43 73.56,3.78 74.98,3.78 75.49,3.28 P9.45 | 67.46,21.06 67.56,21.06 70.1,18.52 70.81,18.52 v71.22,18.11 | 67.46,21.06 66.34,21.06 U$13.15 | v68.99,22.48 68.38,22.48 67.77,23.09 67.77,23.29 67.46,23.6 66.34,23.6 U$13.10 | v67.46,20.85 67.46,21.06 | 64.21,12.93 66.34,12.93 72.24,7.04 72.24,6.53 72.95,5.82 P9.44 | P8.1 19.71,51.43 19.71,45.85 22.45,43.1 22.45,41.78 C14.2 22.45,41.68 22.45,41.48 22.55,41.38 23.16,41.38 23.57,40.97 23.57,39.45 23.67,39.34 23.67,36.7 24.49,35.89 25.6,35.89 C15.2 25.7,35.89 26.11,35.89 26.21,35.79 26.21,34.87 26.31,34.77 30.68,34.77 30.79,34.87 30.79,35.89 31.29,35.89 C16.2 31.39,35.89 32.11,35.89 | 5.79,9.88 v6.71,10.79 6.71,12.12 C19.2 6.71,12.32 6.71,12.72 5.69,12.72 5.59,12.83 5.59,15.77 3.15,18.21 2.03,18.21 R34.1 | 5.79,9.88 5.38,9.47 2.03,9.47 R33.1 | 10.16,8.76 10.16,11.2 U$10.2 | 10.16,8.76 8.84,7.44 8.23,7.44 5.79,9.88 | 10.16,8.76 14.33,4.6 14.53,4.6 H1.GND | 27.53,18.31 27.53,19.43 C10.2 27.53,19.63 27.53,19.94 27.64,20.04 28.45,20.04 28.55,20.14 28.55,22.17 28.45,22.28 27.94,22.28 27.53,22.68 27.53,23.49 C9.2 27.53,23.6 27.53,23.9 27.74,24.1 28.45,24.1 29.36,25.02 29.36,25.53 29.36,25.63 30.07,26.34 31.7,26.34 U$8.1 31.8,26.34 31.8,27.46 31.9,27.56 32.11,27.56 32.21,27.46 32.21,26.34 U$8.2 32.21,26.14 32.21,25.22 32.31,25.12 32.61,25.12 32.72,25.22
  Bottom 0.305: 27.53,18.31 28.45,17.4 30.18,17.4 30.28,17.3 31.6,17.3 C8.2 | 27.53,18.31 v18.9,9.68 16.36,9.68 16.26,9.78 16.26,11.1 U$12.2 | 40.64,43.31 40.54,43.41 39.22,43.41 38.71,43.92 38.71,44.73 38.61,44.83 38.2,44.83 C4.2 38,44.83 32.72,44.83 31.7,45.85 30.48,45.85 C13.2 30.28,45.85 29.87,45.85 29.77,45.74 29.77,42.8 U$7.27 29.77,42.7 29.77,41.58 | U$5.11 41.35,41.99 41.35,43.1 41.25,43.2 40.74,43.2 40.64,43.31 | 29.77,41.58 30.79,41.58 U$7.2 30.99,41.58 32,41.58 32.11,41.68 32.11,41.99 32,42.09 30.89,42.09 U$7.1 | 29.77,41.58 29.77,41.17 29.87,41.07 30.79,41.07 U$7.3 30.89,41.07 32,41.07 32.11,40.97 32.11,40.66 32,40.56 30.89,40.56 U$7.4 30.79,40.56 29.97,40.56 29.87,40.46 29.87,40.16 29.97,40.06 30.79,40.06 U$7.5 30.89,40.06 32,40.06 32.11,39.95 32.11,39.65 32,39.55 | 32.72,25.22 32.72,26.24 U$8.3 32.72,26.34 32.72,32.74 32.11,33.35 32.11,35.89 | 32.82,25.12 32.72,25.22 | 32.82,25.12 33.22,25.12 33.22,26.24 U$8.4 | 32.82,25.12 32.72,25.02 32.72,24.92 33.02,24.61 34.14,24.61 U$8.7 34.14,24.71 34.14,25.02 U$8.6 | 32,39.55 30.89,39.55 U$7.6 | 32.11,35.89 32.11,39.45 32,39.55
  pour Bottom: 0.51,58.14 100.79,58.14 100.79,1.65 -0.1,1.65 -0.1,57.83
  pour Top: 0,59.05 100.48,59.05 100.48,1.75 -0.51,1.75 -0.51,59.16
GPIO1_29
  Bottom 0.152: R35.1 99.06,19.53 99.06,19.84 99.87,20.65 99.87,43.41 88.49,54.79 87.17,54.79 86.46,55.5 83.31,55.5 82.91,55.9 78.44,55.9 76.5,53.97 76.5,53.57 76,53.06 51.1,53.06 50.19,53.97 P8.26
GPIO2_6  (via drill 0.38)
  Top 0.152: P8.45 v56.69,32.64
  Bottom 0.152: v56.69,32.64 50.29,32.64 49.58,31.93 49.38,31.93 R20.1
GPIO2_7  (via drill 0.38)
  Top 0.152: v51.61,31.22 72.03,51.64 72.03,51.94 73.15,53.06 74.57,53.06 P8.46
  Bottom 0.152: v51.61,31.22 51.51,31.22 50.7,30.4 R21.1
GPIO2_8  (via drill 0.38)
  Top 0.152: P8.43 v52.73,31.22
  Bottom 0.152: v52.73,31.22 51.1,29.59 50.09,29.59 49.38,28.88 R22.1
GPIO2_9  (via drill 0.38)
  Top 0.152: v47.75,23.8 48.46,23.09 48.46,22.58 47.95,22.07 47.55,22.07 46.33,23.29 v46.33,34.77 | v67.26,41.78 76.5,51.03 76.5,54.48 76,54.99 74.27,54.99 73.36,54.08 73.05,54.08 P8.44
  Bottom 0.152: v47.75,23.8 47.75,25.42 49.28,26.95 49.28,27.25 R23.1 | v46.33,34.77 60.25,34.77 v67.26,41.78
GPIO2_10  (via drill 0.38)
  Top 0.152: v55.07,26.54 57.4,28.88 58.52,28.88 59.03,29.39 59.03,29.79 58.32,30.5 51.41,30.5 50.9,31.01 50.9,31.93 P8.41
  Bottom 0.152: v55.07,26.54 50.19,26.54 49.58,25.93 49.38,25.93 R24.1
GPIO2_11  (via drill 0.38)
  Top 0.152: v51.51,25.12 51.51,24.61 48.36,21.46 47.14,21.46 45.31,23.29 45.31,35.18 v47.04,36.91 | v54.76,36.91 69.49,51.64 69.49,53.06 P8.42
  Bottom 0.152: v51.51,25.12 50.29,25.12 49.58,24.41 49.38,24.41 R25.1 | v54.76,36.91 v47.04,36.91
GPIO2_12  (via drill 0.38)
  Top 0.152: v47.04,34.06 v47.04,32.64 | P8.39 v50.49,34.06
  Bottom 0.152: v47.04,32.64 46.74,32.33 46.74,21.26 49.28,18.72 49.28,18.41 R26.1 | v50.49,34.06 v47.04,34.06
GPIO2_13  (via drill 0.38)
  Top 0.152: v48.46,25.12 48.46,23.6 48.77,23.29 48.77,22.38 48.16,21.77 47.35,21.77 45.62,23.49 45.62,34.98 46.13,35.48 v47.04,35.48 | v50.8,35.48 66.95,51.64 66.95,53.06 P8.40
  Bottom 0.152: v48.46,25.12 48.46,24.1 49.28,23.29 49.28,22.88 R27.1 | v50.8,35.48 v47.04,35.48
GPIO2_22  (via drill 0.38)
  Top 0.152: v47.75,22.78 47.04,23.49 47.04,31.72 47.75,32.44 47.75,46.56 P8.27
  Bottom 0.152: v47.75,22.78 47.85,22.78 49.28,21.36 R28.1
GPIO2_23  (via drill 0.38)
  Top 0.152: v48.06,31.83 48.06,44.32 P8.29
  Bottom 0.152: v48.06,31.83 47.04,30.81 47.04,22.48 49.28,20.24 49.28,19.94 R29.1
GPIO2_24  (via drill 0.38)
  Top 0.152: v44.3,21.87 44.3,39.95 v46.13,41.78 | v46.13,43.2 46.13,44.32 47.45,45.64 47.45,47.37 51.71,51.64 51.71,53.06 P8.28
  Bottom 0.152: v44.3,21.87 49.28,16.89 R30.1 | v46.13,43.2 v46.13,41.78
I2C2_SCL  (via drill 0.38)
  Top 0.152: v92.05,26.24 92.05,25.22 91.85,25.02 U$3.14 | v46.84,42.49 45.52,42.49 41.66,38.63 v41.66,38.53 36.58,43.61 v28.25,43.61 26.72,42.09 26.72,39.75 29.67,36.8 v29.67,24.31 29.67,22.58 41.25,11 41.25,5.71 42.47,4.5 42.47,3.28 P9.19 | v92.76,33.86 92.35,33.86 83.82,42.39 v77.01,42.39
  Bottom 0.152: 92.76,26.95 93.27,26.95 93.78,26.44 93.78,26.03 93.47,25.73 93.47,20.24 95.1,18.62 95.1,17.4 R3.1 | v92.05,26.24 92.76,26.95 | v28.25,43.61 28.25,42.8 U$7.24 | v41.66,38.53 41.66,38.73 42.16,39.24 42.16,39.65 U$5.2 | v29.67,24.31 30.38,23.6 30.79,23.6 U$8.24 | v46.84,42.49 75.29,42.49 U$1.6 75.39,42.49 75.49,42.39 v77.01,42.39 | v92.76,33.86 92.76,26.95
I2C2_SDA  (via drill 0.38)
  Top 0.152: v92.35,21.56 v94.18,21.56 | v92.35,23.8 92.35,24.61 92.66,24.92 U$3.15 | v94.18,33.35 v88.8,38.73 | P9.20 42.47,5.82 42.47,10.29 32.31,20.45 32.31,21.87 32.92,22.48 v32.92,23.9 v32.92,33.55 | v36.98,42.19 v40.64,38.53 | v68.17,28.57 68.17,27.46 59.13,18.41 59.13,14.45 v53.65,8.97
  Bottom 0.152: v92.35,23.8 v92.35,21.56 | R1.1 95.3,19.84 95.3,20.45 v94.18,21.56 v94.18,33.35 | v88.8,38.73 79.05,38.73 76.61,41.17 75.39,41.17 U$1.5 75.29,41.17 75.29,37.92 67.16,29.79 67.16,29.39 67.97,28.57 v68.17,28.57 | v32.92,23.9 31.29,25.53 30.89,25.53 U$8.28 | 32.56,42.14 32.92,41.78 v32.92,33.55 | 32.56,42.14 32,42.7 30.28,42.7 U$7.28 | v40.64,38.53 41.35,39.24 41.35,39.65 U$5.3 | v36.98,42.19 32.61,42.19 32.56,42.14 | v53.65,8.97 45.72,8.97 P9.20
N$1  (via drill 0.38)
  Top 0.152: v85.65,45.14 v82.8,45.14
  Bottom 0.152: R7.1 85.65,41.38 v85.65,45.14 85.65,46.35 89.31,50.01 89.31,52.15 S1.4 | v82.8,45.14 80.57,45.14 U$1.1
N$2  (via drill 0.38)
  Top 0.152: v82.09,44.42 82.09,45.34 v86.56,49.81
  Bottom 0.152: R2.1 86.06,54.48 86.06,52.04 87.58,50.52 S1.3 87.38,50.62 v86.56,49.81 | v82.09,44.42 81.48,43.81 80.57,43.81 U$1.2
N$3  (via drill 0.38)
  Top 0.152: v78.84,44.02 v76.91,45.95
  Bottom 0.152: R5.1 80.57,55.09 80.16,54.69 78.64,54.69 R4.2 78.54,54.58 78.13,54.58 76.91,53.36 v76.91,45.95 | v78.84,44.02 78.84,43.71 79.96,42.6 80.47,42.6 U$1.3
N$4  (via drill 0.38)
  Top 0.152: v76.1,31.83 66.34,31.83 63.5,28.98 v63.5,27.36
  Bottom 0.152: v76.1,31.83 75.18,31.83 R6.1 | v63.5,27.36 64.72,27.36 64.92,27.56 66.24,27.56 U$13.2
N$5  (via drill 0.38)
  Top 0.152: v86.36,42.8 77.62,42.8 v77.01,43.41 | v46.74,45.85 29.57,45.85 26.11,42.39 26.11,25.42 17.58,16.89 6.6,16.89 4.67,18.82 1.52,18.82 1.32,18.62 1.32,9.07 4.17,6.22 4.17,6.02 TP1.TP
  Bottom 0.152: v86.36,42.8 88.19,42.8 R9.1 | v77.01,43.41 75.69,43.41 75.39,43.71 U$1.7 75.29,43.81 74.78,43.81 72.75,45.85 v46.74,45.85
N$6  (via drill 0.38)
  Top 0.152: v65.13,26.85 v67.87,29.59
  Bottom 0.152: v67.87,29.59 74.37,29.59 75.08,30.3 R8.1 | v65.13,26.85 65.43,26.85 65.63,27.05 66.24,27.05 U$13.3
N$7
  Bottom 0.152: R10.1 73.76,28.78 69.9,28.78 67.26,26.14 66.34,26.14 U$13.5
N$8
  Bottom 0.152: R11.1 73.76,27.25 68.89,27.25 67.26,25.63 66.34,25.63 U$13.6
N$9
  Bottom 0.152: R12.1 73.76,25.83 68.07,25.83 66.85,24.61 66.34,24.61 U$13.8
N$10
  Bottom 0.152: R13.1 73.76,24.31 67.06,24.31 66.85,24.1 66.34,24.1 U$13.9
N$11  (via drill 0.38)
  Top 0.152: v65.13,23.49 v68.89,23.49
  Bottom 0.152: v68.89,23.49 69.49,22.88 73.76,22.88 R14.1 | v65.13,23.49 65.33,23.49 65.63,23.19 66.24,23.19 U$13.11
N$12
  Bottom 0.152: R15.1 75.08,21.36 74.37,22.07 69.49,22.07 69.19,21.77 68.48,21.77 67.67,22.58 66.34,22.58 U$13.12
N$13  (via drill 0.38)
  Top 0.152: v89.92,18.21 91.75,18.21 96.52,22.99 96.52,28.57 95,30.1 94.59,30.1 U$3.10
  Bottom 0.152: v89.92,18.21 87.07,15.37 75.18,15.37 R19.2
N$14  (via drill 0.38)
  Top 0.152: v91.34,29.79 92.66,29.79 94.08,28.37 94.49,28.37 U$3.8
  Bottom 0.152: v91.34,29.79 81.48,19.94 75.18,19.94 R16.2
N$15  (via drill 0.38)
  Top 0.152: v91.34,30.81 92.56,30.81 94.08,29.29 94.49,29.29 U$3.9
  Bottom 0.152: v91.34,30.81 81.18,20.65 74.78,20.65 74.47,20.34 74.47,19.33 75.08,18.72 75.08,18.41 R17.2
N$16  (via drill 0.38)
  Top 0.152: v90.12,26.24 90.83,25.53 90.83,25.02 U$3.13
  Bottom 0.152: R18.2 75.18,16.89 80.77,16.89 v90.12,26.24 92.05,28.17 92.05,34.06 92.56,34.57 93.07,34.57 97.23,38.73 99.16,38.73 99.36,38.94 99.36,43.41 95.1,47.68 94.89,47.68 92.15,44.93 92.15,44.73 94.69,42.19 94.69,41.68 R36.1
N$17
  Bottom 0.152: R28.2 50.7,21.36 57,21.36 57.71,22.07 58.73,22.07 U$13.36
N$18  (via drill 0.38)
  Top 0.152: v3.15,11.1 2.03,11.1 LED1.C
  Bottom 0.152: v3.15,11.1 2.03,11.1 R33.2
N$19  (via drill 0.38)
  Top 0.152: v3.15,16.59 2.03,16.59 LED2.C
  Bottom 0.152: v3.15,16.59 2.03,16.59 R34.2
N$20
  Bottom 0.152: R16.1 73.76,19.94 70.81,19.94 69.29,21.46 68.28,21.46 67.67,22.07 66.34,22.07 U$13.13
N$21
  Bottom 0.152: R17.1 73.76,18.41 71.83,18.41 69.09,21.16 68.07,21.16 67.67,21.56 66.34,21.56 U$13.14
N$22
  Bottom 0.152: R18.1 73.76,16.89 70.51,16.89 66.85,20.55 66.34,20.55 U$13.16
N$23
  Bottom 0.152: R19.1 73.76,15.37 71.53,15.37 66.85,20.04 66.34,20.04 U$13.17
N$24  (via drill 0.38)
  Top 0.152: v77.01,35.08 90.63,35.08 92.96,32.74 92.96,32.03 U$3.1
  Bottom 0.152: v77.01,35.08 73.86,31.93 R6.2
N$25  (via drill 0.38)
  Top 0.152: v86.87,32.33 89.31,34.77 90.42,34.77 92.15,33.04 92.15,32.03 U$3.2
  Bottom 0.152: v86.87,32.33 85.65,31.11 74.78,31.11 74.07,30.4 73.86,30.4 R8.2
N$26  (via drill 0.38)
  Top 0.152: v90.83,33.25 90.83,32.84 91.24,32.44 91.24,32.03 U$3.3
  Bottom 0.152: v90.83,33.25 86.46,28.88 75.18,28.88 R10.2
N$27  (via drill 0.38)
  Top 0.152: v90.32,30.81 90.32,31.93 U$3.4
  Bottom 0.152: v90.32,30.81 86.87,27.36 75.18,27.36 R11.2
N$28  (via drill 0.38)
  Top 0.152: v83.41,25.93 87.07,29.59 87.48,29.59 U$3.17
  Bottom 0.152: v83.41,25.93 75.18,25.93 R12.2
N$29  (via drill 0.38)
  Top 0.152: v82.8,24.41 87.07,28.68 87.48,28.68 U$3.18
  Bottom 0.152: v82.8,24.41 75.18,24.41 R13.2
N$30  (via drill 0.38)
  Top 0.152: v82.19,22.88 87.07,27.76 87.48,27.76 U$3.19
  Bottom 0.152: v82.19,22.88 75.18,22.88 R14.2
N$31  (via drill 0.38)
  Top 0.152: v72.95,21.36 81.99,21.36 87.48,26.85 U$3.20
  Bottom 0.152: v72.95,21.36 73.76,21.36 R15.2
N$32
  Bottom 0.152: R20.2 50.7,31.93 52.93,31.93 57.4,27.46 58.62,27.46 58.73,27.56 U$13.47
N$33  (via drill 0.38)
  Top 0.152: v58.32,29.59 v48.46,29.59
  Bottom 0.152: v48.46,29.59 48.56,29.59 49.28,30.3 R21.2 | v58.32,29.59 59.54,28.37 59.54,27.36 59.33,27.15 58.83,27.15 U$13.46
N$34
  Bottom 0.152: R22.2 50.7,28.78 55.47,28.78 58.12,26.14 58.73,26.14 U$13.44
N$35
  Bottom 0.152: R23.2 50.7,27.25 56.29,27.25 57.71,25.83 58.01,25.83 58.22,25.63 58.73,25.63 U$13.43
N$36
  Bottom 0.152: R24.2 50.7,25.83 55.98,25.83 57.4,24.41 58.01,24.41 58.12,24.51 58.73,24.51 U$13.41
N$37
  Bottom 0.152: R25.2 50.7,24.31 57,24.31 57.2,24.1 58.73,24.1 U$13.40
N$38
  Bottom 0.152: R26.2 50.6,18.41 50.6,18.72 49.99,19.33 49.99,23.39 50.19,23.6 57.71,23.6 58.12,23.19 58.73,23.19 U$13.38
N$39
  Bottom 0.152: R27.2 50.7,22.78 56.69,22.78 57,22.48 58.62,22.48 58.73,22.58 U$13.37
N$40
  Bottom 0.152: R29.2 50.7,19.94 56.08,19.94 57.71,21.56 58.73,21.56 U$13.35
N$41
  Bottom 0.152: R30.2 50.7,16.89 53.54,16.89 57.2,20.55 58.73,20.55 U$13.33
N$42
  Bottom 0.152: R31.2 50.7,15.37 52.53,15.37 57.4,20.24 58.01,20.24 58.12,20.14 58.73,20.14 U$13.32
N$43  (via drill 0.38)
  Top 0.152: v99.06,22.28 99.06,21.16 LED3.C
  Bottom 0.152: v99.06,22.28 99.06,21.26 R35.2
N$45
  Bottom 0.152: C7.1 42.16,44.83 42.16,41.99 U$5.12
N$46
  Bottom 0.152: C7.2 43.79,44.83 43.79,42.7 43.08,41.99 U$5.13
N$47
  Bottom 0.152: C5.1 39.12,36.91 39.12,39.55 39.01,39.65 U$5.6
N$48  (via drill 0.38)
  Top 0.152: v29.57,37.82 v27.43,39.95
  Bottom 0.152: v27.43,39.95 27.13,39.65 26.21,39.65 U$7.15 | v29.57,37.82 29.57,35.89 C16.1
N$50  (via drill 0.38)
  Top 0.152: v36.37,21.97 v34.95,20.55
  Bottom 0.152: v34.95,20.55 34.95,21.26 34.65,21.56 34.24,21.56 U$8.13 | v36.37,21.97 37.29,21.97 37.49,22.17 C11.1
N$51  (via drill 0.38)
  Top 0.152: v36.37,19.13 v34.95,19.13
  Bottom 0.152: v34.95,19.13 34.24,19.84 34.24,21.06 U$8.14 | v36.37,19.13 36.37,19.33 37.49,20.45 C11.2 37.59,20.55 38.3,21.26 38.3,22.78 37.59,23.49 37.59,24.41 C12.2
N$52
  Bottom 0.152: U$8.5 34.24,25.63 36.98,25.63 37.49,26.14 C12.1
N$53  (via drill 0.38)
  Top 0.152: v9.14,8.76 11.89,8.76 13.41,10.29 15.24,10.29 C18.1
  Bottom 0.152: v9.14,8.76 9.14,10.08 8.64,10.59 8.64,13.23 9.14,13.74 U$10.4
N$54  (via drill 0.38)
  Top 0.152: v91.14,8.97 90.83,8.97 84.23,15.57 84.23,17.91 89.92,23.6 89.92,24.92 U$3.12
  Bottom 0.152: v91.14,8.97 91.14,8.56 92.46,7.24 R38.1
N$55
  Bottom 0.152: R37.2 95.4,12.12 93.07,12.12 92.86,11.91 U$4.3
N$56  (via drill 0.38)
  Top 0.152: v16.15,13.44 16.15,14.96 15.85,15.26 14.63,15.26 14.33,14.96 12.9,14.96 C21.1
  Bottom 0.152: v16.15,13.44 15.65,13.44 15.34,13.74 U$12.4
N$57
  Bottom 0.152: R38.2 92.56,8.46 93.27,7.75 93.27,6.83 92.96,6.53 90.22,6.53 89.51,7.24 89.51,11.2 90.12,11.81 U$4.4
TIMER5  (via drill 0.38)
  Top 0.152: 56.95,14.91 57.91,15.87 v58.01,15.87 | 56.95,14.91 v56.59,14.55 | v57.61,28.17 57.61,26.03 57.35,25.78 | 57.35,25.78 56.9,25.32 56.9,14.96 56.95,14.91 | v48.77,43.51 48.77,30.81 47.75,29.79 47.75,29.39 51.31,25.83 57.3,25.83 57.35,25.78
  Bottom 0.152: v56.59,14.55 50.19,14.55 49.58,13.94 49.38,13.94 R32.1 | v58.01,15.87 58.73,16.59 U$13.25 | v57.61,28.17 58.73,28.17 U$13.48 | v48.77,43.51 47.65,43.51 45.01,46.15 36.37,46.15 31.09,51.43 29.87,51.43 P8.9
UART1_RXD  (via drill 0.38)
  Top 0.152: v27.43,41.07 27.43,40.87 39.52,28.78 39.52,19.02 46.28,12.27 | 46.28,12.27 50.09,8.46 50.09,5.82 P9.26 | 46.28,12.27 v46.63,12.62
  Bottom 0.152: v27.43,41.07 26.21,41.07 U$7.18 | v46.63,12.62 49.28,15.26 R31.1
UART1_TXD  (via drill 0.38)
  Top 0.152: v42.47,12.62 42.47,10.9 47.55,5.82 P9.24
  Bottom 0.152: v42.47,12.62 42.47,22.68 36.37,28.78 36.37,40.56 38.61,42.8 39.42,42.8 39.73,42.49 39.73,41.99 U$5.9
UART4_TXD  (via drill 0.38)
  Top 0.152: v39.83,37.92 39.83,20.34 50.8,9.37 v50.8,7.54
  Bottom 0.152: v39.83,37.92 39.83,39.65 U$5.5 | v50.8,7.54 45.41,7.54 43.48,5.61 43.48,5.31 42.37,4.19 35.87,4.19 P9.13
VDD
  Top 0.152: P9.5 24.79,3.28 24.79,5.71 P9.6

### Text on the board
tPlace: hitchhikeree.org | Interacto
bPlace: hitchhikeree.org | Interacto